# EAGLE design blimpy (EAGLE 9.5.0)
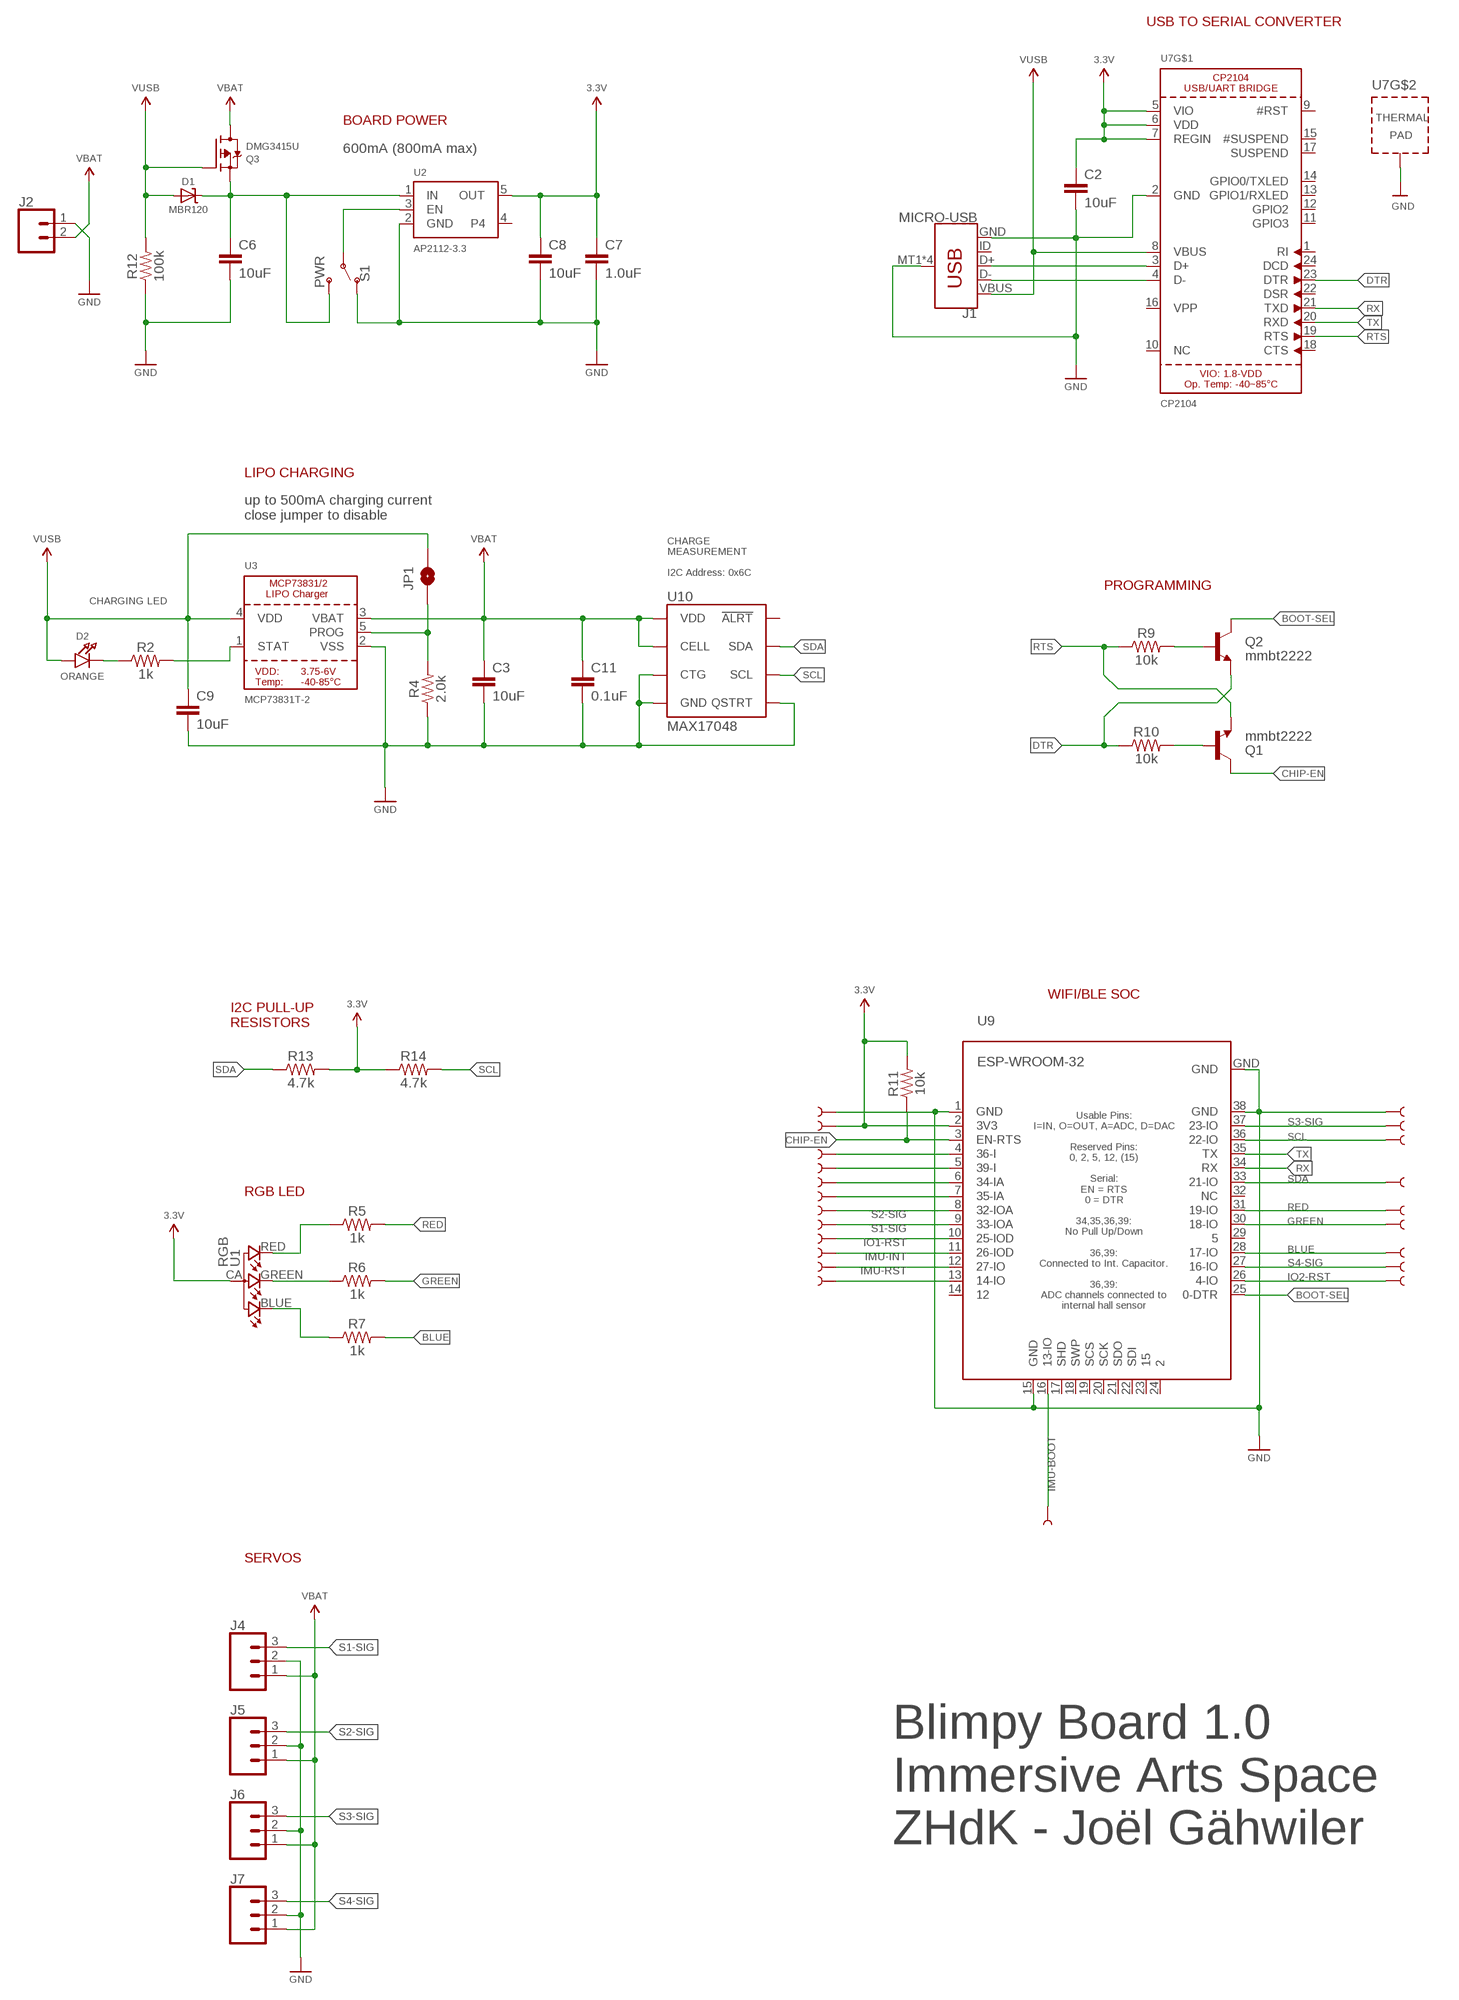
[diagram p0: schematic, sheet 1, part 1 of 2]
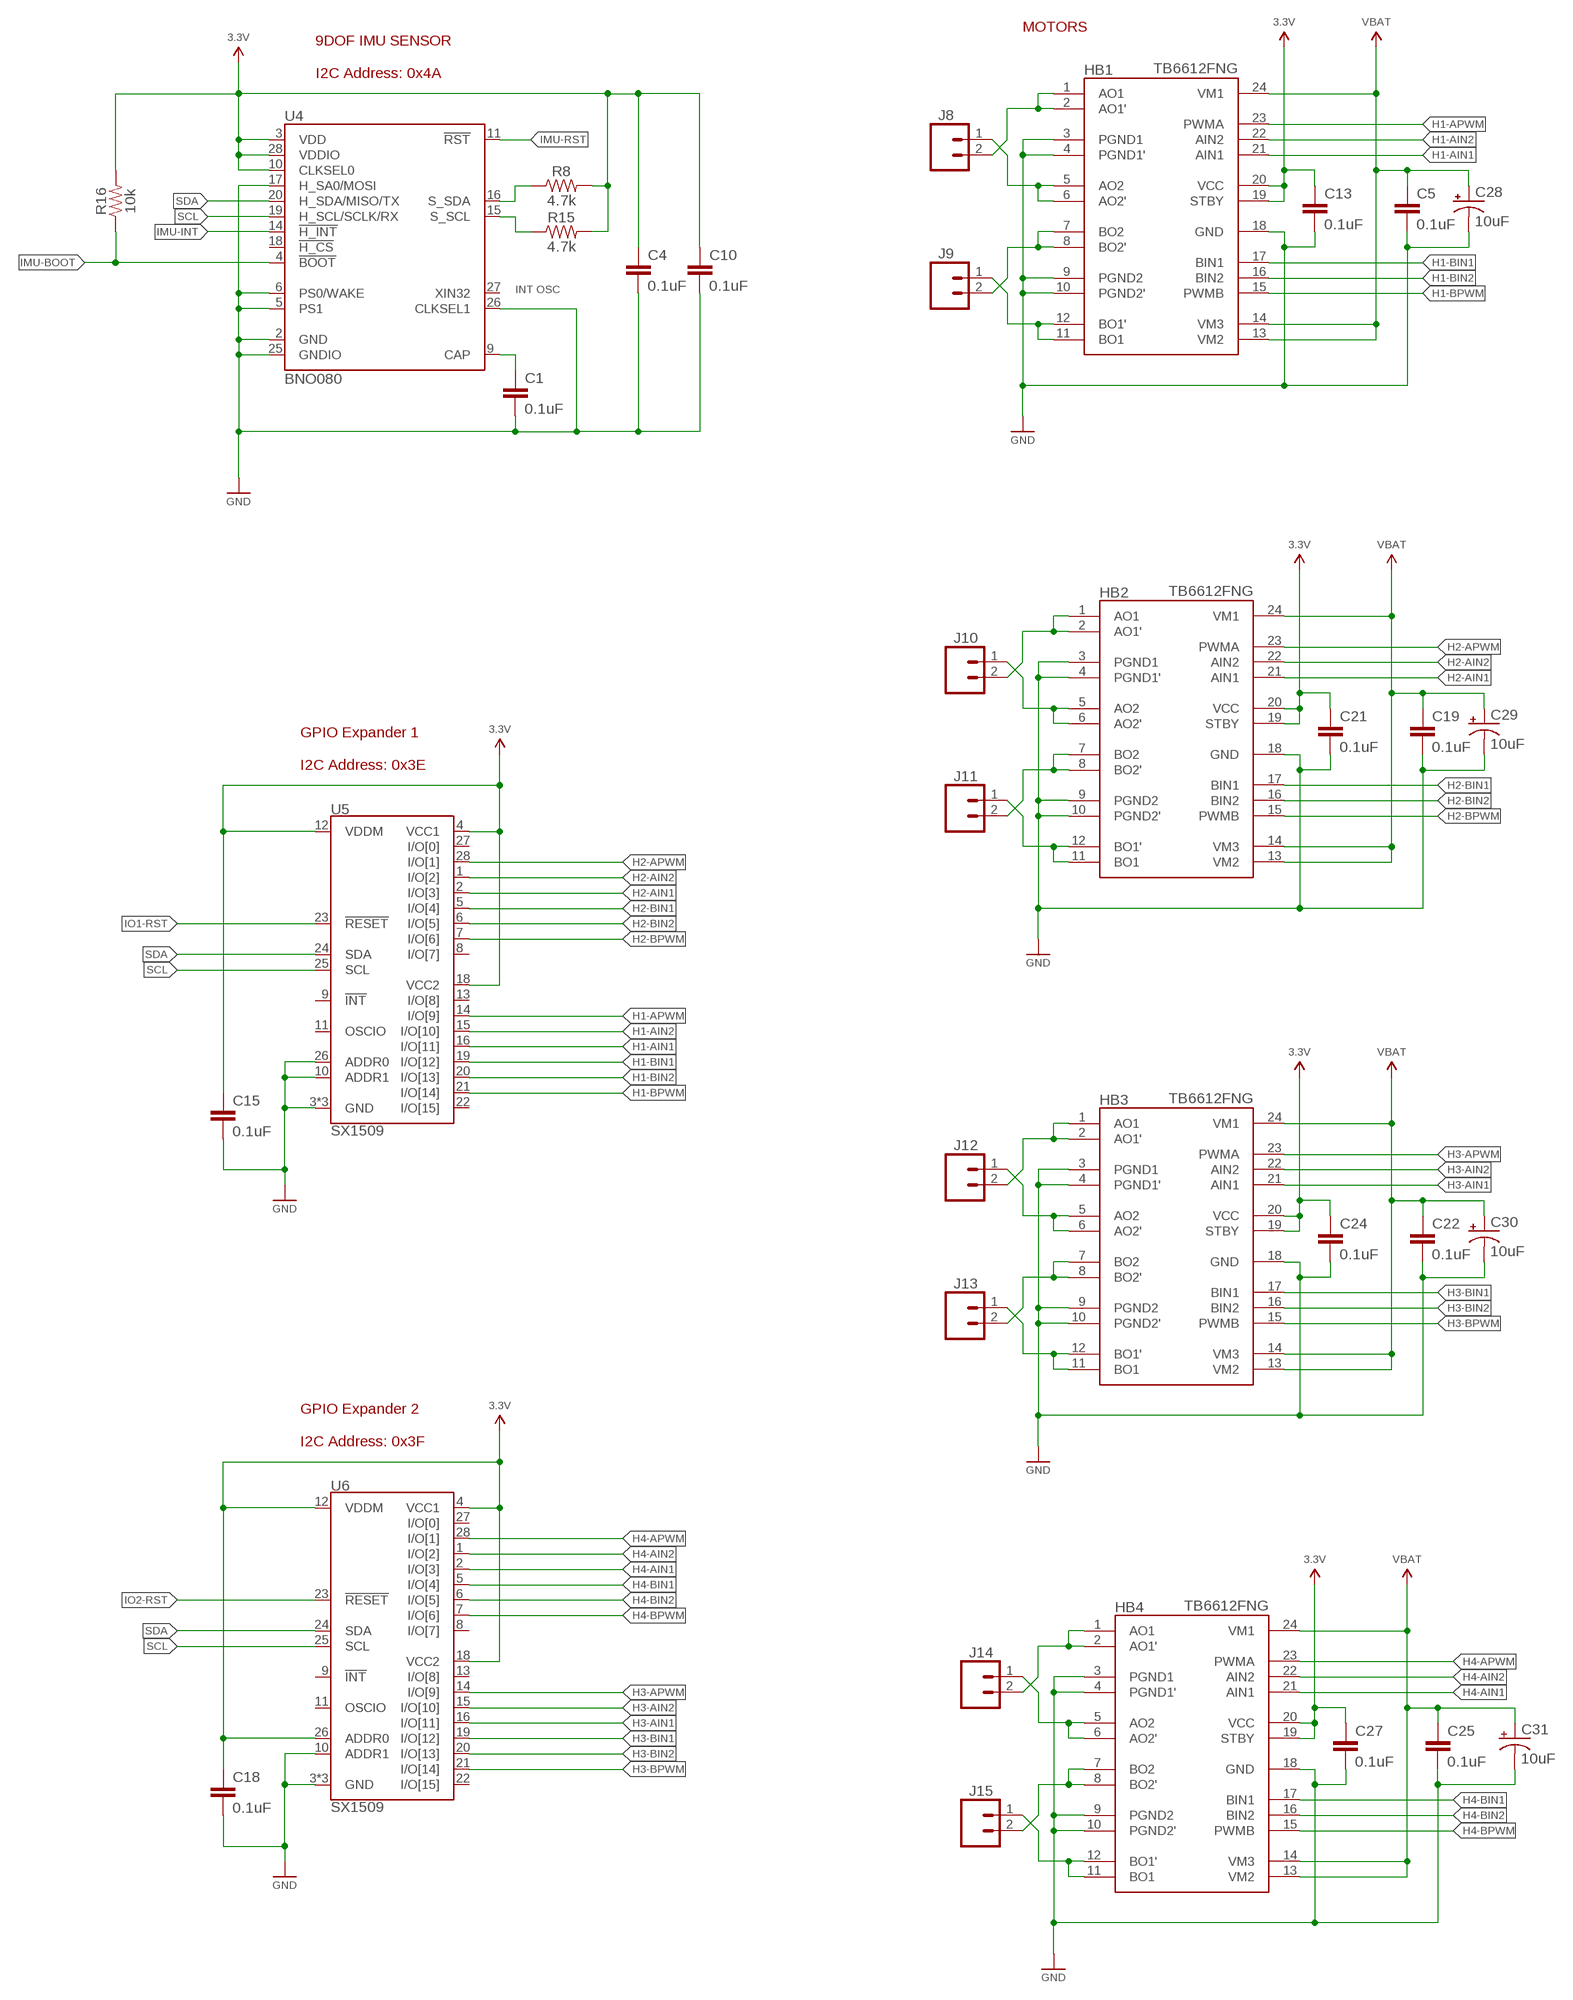
[diagram p1: schematic, sheet 1, part 2 of 2]

## Parts
C1  0.1uF  0.1UF-0603-25V-5%  [0603]
C2  10uF  10UF-0603-6.3V-20%  [0603]
C3  10uF  10UF-0603-6.3V-20%  [0603]
C4  0.1uF  0.1UF-0603-25V-5%  [0603]
C5  0.1uF  0.1UF-0603-25V-5%  [0603]
C6  10uF  10UF-0603-6.3V-20%  [0603]
C7  1.0uF  1.0UF-0603-16V-10%  [0603]
C8  10uF  10UF-0603-6.3V-20%  [0603]
C9  10uF  10UF-0603-6.3V-20%  [0603]
C10  0.1uF  0.1UF-0603-25V-5%  [0603]
C11  0.1uF  0.1UF-0603-25V-5%  [0603]
C13  0.1uF  0.1UF-0603-25V-5%  [0603]
C15  0.1uF  0.1UF-0603-25V-5%  [0603]
C18  0.1uF  0.1UF-0603-25V-5%  [0603]
C19  0.1uF  0.1UF-0603-25V-5%  [0603]
C21  0.1uF  0.1UF-0603-25V-5%  [0603]
C22  0.1uF  0.1UF-0603-25V-5%  [0603]
C24  0.1uF  0.1UF-0603-25V-5%  [0603]
C25  0.1uF  0.1UF-0603-25V-5%  [0603]
C27  0.1uF  0.1UF-0603-25V-5%  [0603]
C28  10uF  10UF-POLAR-EIA3216-16V-10%(TANT)  [EIA3216]
C29  10uF  10UF-POLAR-EIA3216-16V-10%(TANT)  [EIA3216]
C30  10uF  10UF-POLAR-EIA3216-16V-10%(TANT)  [EIA3216]
C31  10uF  10UF-POLAR-EIA3216-16V-10%(TANT)  [EIA3216]
D1  MBR120  DIODE-SCHOTTKYSOD-123  [SOD-123]
D2  ORANGE  LED0805_NOOUTLINE  [CHIPLED_0805_NOOUTLINE]
HB1  TB6612FNG  [SSOP24]
HB2  TB6612FNG  [SSOP24]
HB3  TB6612FNG  [SSOP24]
HB4  TB6612FNG  [SSOP24]
J1  MICRO-USB  USB_MICRO-B_SMT  [USB-MICROB]
J2  CONN_02-JST-2MM-SMT  [JST-2-SMD]
J4  3-PIN SMD  CONN_03JST-SMD  [JST-3-SMD]
J5  3-PIN SMD  CONN_03JST-SMD  [JST-3-SMD]
J6  3-PIN SMD  CONN_03JST-SMD  [JST-3-SMD]
J7  3-PIN SMD  CONN_03JST-SMD  [JST-3-SMD]
J8  CONN_02-JST-2MM-SMT  [JST-2-SMD]
J9  CONN_02-JST-2MM-SMT  [JST-2-SMD]
J10  CONN_02-JST-2MM-SMT  [JST-2-SMD]
J11  CONN_02-JST-2MM-SMT  [JST-2-SMD]
J12  CONN_02-JST-2MM-SMT  [JST-2-SMD]
J13  CONN_02-JST-2MM-SMT  [JST-2-SMD]
J14  CONN_02-JST-2MM-SMT  [JST-2-SMD]
J15  CONN_02-JST-2MM-SMT  [JST-2-SMD]
JP1  JUMPER-SMT_2_NO_SILK  [SMT-JUMPER_2_NO_SILK]
Q1  mmbt2222  TRANSISTOR_NPNSOT23-3  [SOT23-3]
Q2  mmbt2222  TRANSISTOR_NPNSOT23-3  [SOT23-3]
Q3  DMG3415U  MOSFET-P  [SOT23-R]
R2  1k  1KOHM-0603-1/10W-1%  [0603]
R4  2.0k  2.0KOHM-0603-1/10W-5%  [0603]
R5  1k  1KOHM-0603-1/10W-1%  [0603]
R6  1k  1KOHM-0603-1/10W-1%  [0603]
R7  1k  1KOHM-0603-1/10W-1%  [0603]
R8  4.7k  4.7KOHM-0603-1/10W-1%  [0603]
R9  10k  10KOHM-0603-1/10W-1%  [0603]
R10  10k  10KOHM-0603-1/10W-1%  [0603]
R11  10k  10KOHM-0603-1/10W-1%  [0603]
R12  100k  100KOHM-0603-1/10W-1%  [0603]
R13  4.7k  4.7KOHM-0603-1/10W-1%  [0603]
R14  4.7k  4.7KOHM-0603-1/10W-1%  [0603]
R15  4.7k  4.7KOHM-0603-1/10W-1%  [0603]
R16  10k  10KOHM-0603-1/10W-1%  [0603]
S1  PWR  SWITCH-SPDT-SMD-RIGHT-ANGLE  [SWITCH_SPST_SMD_A]
TP1  TEST-POINT3  [PAD.03X.03]
TP2  TEST-POINT3  [PAD.03X.03]
TP3  TEST-POINT3  [PAD.03X.03]
TP4  TEST-POINT3  [PAD.03X.03]
TP5  TEST-POINT3  [PAD.03X.03]
TP6  TEST-POINT3  [PAD.03X.03]
TP7  TEST-POINT3  [PAD.03X.03]
TP8  TEST-POINT3  [PAD.03X.03]
TP9  TEST-POINT3  [PAD.03X.03]
TP10  TEST-POINT3  [PAD.03X.03]
TP11  TEST-POINT3  [PAD.03X.03]
TP12  TEST-POINT3  [PAD.03X.03]
TP13  TEST-POINT3  [PAD.03X.03]
TP14  TEST-POINT3  [PAD.03X.03]
TP15  TEST-POINT3  [PAD.03X.03]
TP16  TEST-POINT3  [PAD.03X.03]
TP17  TEST-POINT3  [PAD.03X.03]
TP18  TEST-POINT3  [PAD.03X.03]
TP19  TEST-POINT3  [PAD.03X.03]
TP20  TEST-POINT3  [PAD.03X.03]
TP21  TEST-POINT3  [PAD.03X.03]
TP22  TEST-POINT3  [PAD.03X.03]
U1  RGB  RGB-LED-CLMVB-FKARGB  [PLCC4-2MM-RGB]
U2  AP2112-3.3  VREG_SOT23-5  [SOT23-5]
U3  MCP73831T-2  MCP73831/2  [SOT23-5]
U4  BNO080  [LGA-28]
U5  SX1509  [QFN-28]
U6  SX1509  [QFN-28]
U7  CP2104  [QFN24_4MM_SMSC]
U9  ESP-WROOM-32  [ESP-WROOM-32]
U10  MAX17048  MAX17048DFN8  [DFN-8]

## Nets
3.3V: C2.1 C4.1 C7.1 C8.1 C10.1 C13.1 C15.1 C18.1 C21.1 C24.1 C27.1 HB1.19(STBY) HB1.20(VCC) HB2.19(STBY) HB2.20(VCC) HB3.19(STBY) HB3.20(VCC) HB4.19(STBY) HB4.20(VCC) R8.2 R11.2 R13.2 R14.1 R15.2 R16.2 TP11.P$1 U1.CA U2.5(OUT) U4.3(VDD) U4.10(CLKSEL0) U4.28(VDDIO) U5.4(VCC1) U5.12(VDDM) U5.18(VCC2) U6.4(VCC1) U6.12(VDDM) U6.18(VCC2) U6.26(ADDR0) U7.5(VIO) U7.6(VDD) U7.7(REGIN) U9.2(3V3)
BLUE: R7.2 TP22.P$1 U9.28(17-IO)
BOOT-SEL: Q2.3(C) U9.25(0-DTR)
CHIP-EN: Q1.3(C) R11.1 U9.3(EN-RTS)
DTR: Q2.2(E) R10.1 U7.23(DTR)
GND: C1.2 C2.2 C3.2 C4.2 C5.2 C6.2 C7.2 C8.2 C9.2 C10.2 C11.2 C13.2 C15.2 C18.2 C19.2 C21.2 C22.2 C24.2 C25.2 C27.2 C28.- C29.- C30.- C31.- HB1.3(PGND1) HB1.4(PGND1') HB1.9(PGND2) HB1.10(PGND2') HB1.18(GND) HB2.3(PGND1) HB2.4(PGND1') HB2.9(PGND2) HB2.10(PGND2') HB2.18(GND) HB3.3(PGND1) HB3.4(PGND1') HB3.9(PGND2) HB3.10(PGND2') HB3.18(GND) HB4.3(PGND1) HB4.4(PGND1') HB4.9(PGND2) HB4.10(PGND2') HB4.18(GND) J1.GND J1.MT1(SHIELD) J1.MT2(SHIELD) J1.P$1(SHIELD) J1.P$2(SHIELD) J2.1 J4.2 J5.2 J6.2 J7.2 R4.1 R12.1 S1.1(O) TP12.P$1 TP13.P$1 U2.2(GND) U3.2(VSS) U4.2(GND) U4.5(PS1) U4.6(PS0/WAKE) U4.17(H_SA0/MOSI) U4.25(GNDIO) U4.26(CLKSEL1) U5.3(GND) U5.10(ADDR1) U5.17(GND) U5.26(ADDR0) U5.29(GND) U6.3(GND) U6.10(ADDR1) U6.17(GND) U6.29(GND) U7.2(GND) U7.THERM(TP) U9.1(GND) U9.15(GND) U9.38(GND) U9.GND U10.P$1(CTG) U10.P$4(GND) U10.P$6(QSTRT) U10.P$9(GND)
GREEN: R6.2 TP21.P$1 U9.30(18-IO)
H1-AIN1: HB1.21(AIN1) U5.16(I/O[11])
H1-AIN2: HB1.22(AIN2) U5.15(I/O[10])
H1-APWM: HB1.23(PWMA) U5.14(I/O[9])
H1-BIN1: HB1.17(BIN1) U5.19(I/O[12])
H1-BIN2: HB1.16(BIN2) U5.20(I/O[13])
H1-BPWM: HB1.15(PWMB) U5.21(I/O[14])
H2-AIN1: HB2.21(AIN1) U5.2(I/O[3])
H2-AIN2: HB2.22(AIN2) U5.1(I/O[2])
H2-APWM: HB2.23(PWMA) U5.28(I/O[1])
H2-BIN1: HB2.17(BIN1) U5.5(I/O[4])
H2-BIN2: HB2.16(BIN2) U5.6(I/O[5])
H2-BPWM: HB2.15(PWMB) U5.7(I/O[6])
H3-AIN1: HB3.21(AIN1) U6.16(I/O[11])
H3-AIN2: HB3.22(AIN2) U6.15(I/O[10])
H3-APWM: HB3.23(PWMA) U6.14(I/O[9])
H3-BIN1: HB3.17(BIN1) U6.19(I/O[12])
H3-BIN2: HB3.16(BIN2) U6.20(I/O[13])
H3-BPWM: HB3.15(PWMB) U6.21(I/O[14])
H4-AIN1: HB4.21(AIN1) U6.2(I/O[3])
H4-AIN2: HB4.22(AIN2) U6.1(I/O[2])
H4-APWM: HB4.23(PWMA) U6.28(I/O[1])
H4-BIN1: HB4.17(BIN1) U6.5(I/O[4])
H4-BIN2: HB4.16(BIN2) U6.6(I/O[5])
H4-BPWM: HB4.15(PWMB) U6.7(I/O[6])
HB1-A1: HB1.1(AO1) HB1.2(AO1') J8.2
HB1-A2: HB1.5(AO2) HB1.6(AO2') J8.1
HB1-B1: HB1.11(BO1) HB1.12(BO1') J9.1
HB1-B2: HB1.7(BO2) HB1.8(BO2') J9.2
HB2-A1: HB2.1(AO1) HB2.2(AO1') J10.2
HB2-A2: HB2.5(AO2) HB2.6(AO2') J10.1
HB2-B1: HB2.11(BO1) HB2.12(BO1') J11.1
HB2-B2: HB2.7(BO2) HB2.8(BO2') J11.2
HB3-A1: HB3.1(AO1) HB3.2(AO1') J12.2
HB3-A2: HB3.5(AO2) HB3.6(AO2') J12.1
HB3-B1: HB3.11(BO1) HB3.12(BO1') J13.1
HB3-B2: HB3.7(BO2) HB3.8(BO2') J13.2
HB4-A1: HB4.1(AO1) HB4.2(AO1') J14.2
HB4-A2: HB4.5(AO2) HB4.6(AO2') J14.1
HB4-B1: HB4.11(BO1) HB4.12(BO1') J15.1
HB4-B2: HB4.7(BO2) HB4.8(BO2') J15.2
IMU-BOOT: R16.1 TP17.P$1 U4.4(!BOOT) U9.16(13-IO)
IMU-INT: TP4.P$1 U4.14(!H_INT) U9.11(26-IOD)
IMU-RST: TP5.P$1 U4.11(!RST) U9.12(27-IO)
IO1-RST: TP3.P$1 U5.23(!RESET) U9.10(25-IOD)
IO2-RST: TP16.P$1 U6.23(!RESET) U9.26(4-IO)
N$1: D2.C R2.1
N$2: J1.D+ U7.3(D+)
N$3: R2.2 U3.1(STAT)
N$4: JP1.1 R4.2 U3.5(PROG)
N$6: J1.D- U7.4(D-)
N$7: C6.1 D1.C Q3.2(S) S1.3(S) U2.1(IN)
N$8: S1.2(P) U2.3(EN)
N$9: R5.1 U1.RED
N$10: R7.1 U1.BLUE
N$11: R6.1 U1.GREEN
N$12: Q1.1(B) R10.2
N$13: Q2.1(B) R9.2
N$14: R8.1 U4.16(S_SDA)
N$15: R15.1 U4.15(S_SCL)
N$16: C1.1 U4.9(CAP)
N$18: TP10.P$1 U9.4(36-I)
N$19: TP9.P$1 U9.5(39-I)
N$20: TP8.P$1 U9.6(34-IA)
N$21: TP7.P$1 U9.7(35-IA)
N$22: TP6.P$1 U9.13(14-IO)
RED: R5.2 TP20.P$1 U9.31(19-IO)
RTS: Q1.2(E) R9.1 U7.19(RTS)
RX: U7.21(TXD) U9.34(RX)
S1-SIG: J4.3 TP2.P$1 U9.9(33-IOA)
S2-SIG: J5.3 TP1.P$1 U9.8(32-IOA)
S3-SIG: J6.3 TP14.P$1 U9.37(23-IO)
S4-SIG: J7.3 TP15.P$1 U9.27(16-IO)
SCL: R14.2 TP18.P$1 U4.19(H_SCL/SCLK/RX) U5.25(SCL) U6.25(SCL) U9.36(22-IO) U10.P$7(SCL)
SDA: R13.1 TP19.P$1 U4.20(H_SDA/MISO/TX) U5.24(SDA) U6.24(SDA) U9.33(21-IO) U10.P$8(SDA)
TX: U7.20(RXD) U9.35(TX)
V_BATT: C3.1 C5.1 C11.1 C19.1 C22.1 C25.1 C28.+ C29.+ C30.+ C31.+ HB1.13(VM2) HB1.14(VM3) HB1.24(VM1) HB2.13(VM2) HB2.14(VM3) HB2.24(VM1) HB3.13(VM2) HB3.14(VM3) HB3.24(VM1) HB4.13(VM2) HB4.14(VM3) HB4.24(VM1) J2.2 J4.1 J5.1 J6.1 J7.1 Q3.3(D) U3.3(VBAT) U10.P$2(CELL) U10.P$3(VDD) ; supply symbol labelled VBAT
V_USB: C9.1 D1.A D2.A J1.VBUS JP1.2 Q3.1(G) R12.2 U3.4(VDD) U7.8(VBUS) ; supply symbol labelled VUSB
Unconnected: J1.ID U2.4 U4.18(!H_CS) U4.27(XIN32) U5.8(I/O[7]) U5.9(!INT) U5.11(OSCIO) U5.13(I/O[8]) U5.22(I/O[15]) U5.27(I/O[0]) U6.8(I/O[7]) U6.9(!INT) U6.11(OSCIO) U6.13(I/O[8]) U6.22(I/O[15]) U6.27(I/O[0]) U7.1(RI) U7.9(#RST) U7.10(NC) U7.11(GPIO3) U7.12(GPIO2) U7.13(GPIO1/RXLED) U7.14(GPIO0/TXLED) U7.15(#SUSPEND) U7.16(VPP) U7.17(SUSPEND) U7.18(CTS) U7.22(DSR) U7.24(DCD) U9.14 U9.17(SHD) U9.18(SWP) U9.19(SCS) U9.20(SCK) U9.21(SDO) U9.22(SDI) U9.23 U9.24 U9.29 U9.32(NC) U10.P$5(!ALRT)

## Notes on the sheet
- MOTORS
- USB TO SERIAL CONVERTER
- 9DOF IMU SENSOR
  
  I2C Address: 0x4A
- BOARD POWER
- 600mA (800mA max)
- INT OSC
- LIPO CHARGING
- up to 500mA charging current
  close jumper to disable
- CHARGE
  MEASUREMENT
  
  I2C Address: 0x6C
- PROGRAMMING
- CHARGING LED
- GPIO Expander 1
  
  I2C Address: 0x3E
- WIFI/BLE SOC
- I2C PULL-UP
  RESISTORS
- RGB LED
- GPIO Expander 2
  
  I2C Address: 0x3F
- SERVOS
- Blimpy Board 1.0
  Immersive Arts Space
  ZHdK - Joël Gähwiler

## Library data of the parts
C1 C4 C5 C10 C11 C13 C15 C18 C19 C21 C22 C24 C25 C27 = SparkFun-Capacitors:0.1UF: 0.1µF ceramic capacitors A capacitor is a passive two-terminal electrical component used to store electrical energy temporarily in an electric field.; PROD_ID: CAP-08604
C2 C3 C6 C8 C9 = SparkFun-Capacitors:10UF: 10.0µF ceramic capacitors A capacitor is a passive two-terminal electrical component used to store electrical energy temporarily in an electric field.; PROD_ID: CAP-11015
C7 = SparkFun-Capacitors:1.0UF: 1µF ceramic capacitors A capacitor is a passive two-terminal electrical component used to store electrical energy temporarily in an electric field.; PROD_ID: CAP-00868
C28-C31 = SparkFun-Capacitors:10UF-POLAR: 10.0µF polarized capacitors A capacitor is a passive two-terminal electrical component used to store electrical energy temporarily in an electric field.; PROD_ID: CAP-00811
D1 = microbuilder:DIODE-SCHOTTKY
D2 = microbuilder:LED: LED 0603 - 0603 Surface Mount Package 2mA: Green LED - Low Power (3.9mcd, 2ma, 1.7Vf) - Digikey: 475-2709-2-ND Orange LED - Low Power (9.8mcd, 2ma, 1.8Vf) - Digikey: 475-1194-2-ND Red LED - Low Power (5mcd, 2ma, 1.8Vf) - Digikey: 475-1195-2-ND Yellow LED - Low Power (7mcd, 2ma, 1.8Vf) - Digikey: 475-1196-2-ND 5mA: Blue LED - Low Power (17mcd, 5ma, 2.9Vf) - Digikey: LNJ937W8CRACT-ND 0805 - 0805 Surface Mount Package 2mA: Red LED (8.8mcd, 2mA, 1.8Vf, Clear) - Low Power [Digikey: 475-2510-1-ND] Green LED (5mcd, 2mA, 1.8Vf, Clear) - Low Power [Digikey: 475-2730-1-ND] Yellow LED (11.3mcd, 2mA, 1.8Vf, Clear) - Low Power [Digikey: 475-2555-1-ND] 20mA: Red LED (104mcd, 20mA, Diffused) - LS R976 [Digikey: 475-1278-6-ND] Red LED (12mcd, 20mA, 2.0Vf, Clear) - APT2012EC [Digikey: 754-1128-1-ND] Green LED (15mcd, 20mA, 2.2Vf, Clear) - APT2012GC [Digikey: 754-1131-1-ND] Orange LED (160mcd, 20mA, 2.1Vf, Clear) - APT2012SECK [Digikey: 754-1130-1-ND] 1206 - 1206 Surface Mount Package Green LED (26mcd, 20mA, Diffused) - LG N971 [Digikey: 475-1407-6-ND] Red LED (15mcd, 20mA, Diffused) - LH N974 [Digikey: 475-1416-6-ND] Cree - Cree High-Power Surface Mount LEDs XPEBWT-L1-0000-00D50 - White 111lm 350mA 2.9Vf 6200K 110° XTEAWT-00-0000-00000LEE3 - White 114lm 350mA 2.85Vf 5000K 115° Everlight - Everlight 45-21 Series Surface Mount LEDs 45-21/QK2C-B2832AC2CB2/2T - Warm White 2000mcd 20mA 3.25Vf 3050K 120° 45-21/LK2C-B38452C4CB2/2T - Nuetral White 2000mcd 20mA 3.25Vf 4150K 120° 45-21/LK2C-B50634C6CB2/2T - Cold White 2200mcd 20mA 3.25Vf 5650K 120° PLCC2 Reverse Mount LS T77K-J1L2-1-0-2-R18-Z - Red 11.25mcd 2mA 1.8Vf 630nm 120° LO T77K-L1M2-24-Z - Orange 19.6mcd 2mA 1.8Vf 606nm 120° LY T77K-K2M1-26-Z - Yellow 15.7mcd 2mA 1.8Vf 587nm 120°
HB1-HB4 = adafruit:TB6612FNG: TB6612FNG MOS dual H-bridge motor driver, 1.2A current 3.2A peak 3 or 5v logic and 3-15v motor
J1 = SparkFun-Connectors:USB_MICRO-B: USB Type Micro-B Connector Male/female and PTH/SMT variants SparkFun Products: SparkFun microB USB Breakout <https://www.sparkfun.com/products/12035> SparkFun USB microB Plug Breakout <https://www.sparkfun.com/products/10031> SparkFun ESP8266 Thing <https://www.sparkfun.com/products/13231>; PROD_ID: CONN-09505; SF_ID: PRT-08533
J2 J8-J15 = SparkFun-Connectors:CONN_02: Multi connection point. Often used as Generic Header-pin footprint for 0.1 inch spaced/style header connections On any of the 0.1 inch spaced packages, you can populate with these: Break Away Headers - Straight <https://www.sparkfun.com/products/116> (PRT-00116) Break Away Male Headers - Right Angle <https://www.sparkfun.com/products/553> (PRT-00553) Female Headers <https://www.sparkfun.com/products/115> (PRT-00115) Break Away Headers - Machine Pin <https://www.sparkfun.com/products/117> (PRT-00117) Break Away Female Headers - Swiss Machine Pin <https://www.sparkfun.com/products/743> (PRT-00743) For SCREWTERMINALS and SPRING TERMINALS visit here: Screw Terimnals on SparkFun.com <https://www.sparkfun.com/search/results?term=Screw+Terminals> (5mm/3.5mm/2.54mm spacing) This device is also useful as a general connection point to wire up your design to another part of your project. Our various solder wires solder well into these plated through hole pads. Hook-Up Wire - Assortment (Stranded, 22 AWG) <https://www.sparkfun.com/products/11375> (PRT-11375) Hook-Up Wire - Assortment (Solid Core, 22 AWG) <https://www.sparkfun.com/products/11367> (PRT-11367) View the entire wire category on our website here <https://www.sparkfun.com/categories/141> Special notes: Molex polarized connector foot print use with: PRT-08233 with associated crimp pins and housings. 2.54_SCREWTERM for use with PRT-10571. 3.5mm Screw Terminal footprints for PRT-08084 5mm Screw Terminal footprints for use with PRT-08432; PROD_ID: CONN-11443
J4-J7 = SparkFun-Connectors:CONN_03: Multi connection point. Often used as Generic Header-pin footprint for 0.1 inch spaced/style header connections On any of the 0.1 inch spaced packages, you can populate with these: Break Away Headers - Straight <https://www.sparkfun.com/products/116> (PRT-00116) Break Away Male Headers - Right Angle <https://www.sparkfun.com/products/553> (PRT-00553) Female Headers <https://www.sparkfun.com/products/115> (PRT-00115) Break Away Headers - Machine Pin <https://www.sparkfun.com/products/117> (PRT-00117) Break Away Female Headers - Swiss Machine Pin <https://www.sparkfun.com/products/743> (PRT-00743) Stackable Header - 3 Pin (Female, 0.1") <https://www.sparkfun.com/products/13875> (PRT-13875) For SCREWTERMINALS and SPRING TERMINALS visit here: Screw Terimnals on SparkFun.com <https://www.sparkfun.com/search/results?term=Screw+Terminals> (5mm/3.5mm/2.54mm spacing) This device is also useful as a general connection point to wire up your design to another part of your project. Our various solder wires solder well into these plated through hole pads. Hook-Up Wire - Assortment (Stranded, 22 AWG) <https://www.sparkfun.com/products/11375> (PRT-11375) Hook-Up Wire - Assortment (Solid Core, 22 AWG) <https://www.sparkfun.com/products/11367> (PRT-11367) View the entire wire category on our website here <https://www.sparkfun.com/categories/141> Special notes: Molex polarized connector foot print use with SKU : PRT-08232 with associated crimp pins and housings.; PROD_ID: CONN-12591
JP1 = SparkFun-Jumpers:JUMPER-SMT_2_NO: Normally open jumper This jumper has two pads in close proximity to each other. Apply solder to close the connection. Round pads are easier to solder for beginners, but are a lot larger. SparkFun Product that uses the round pads: SparkFun EL Sequencer <https://www.sparkfun.com/products/12781>
Q1 Q2 = SparkFun:TRANSISTOR_NPN: Transistor NPN BJT configuration in SOT23 package. MMBT2222 is the common NPN we use. Double check BCE configuration again layout.
Q3 = microbuilder:MOSFET-P: P-Channel Mosfet LEGEND VDS: Voltage Drain-Source ID: Drain Current RDS(ON): Drain-Source On-State Resistance VGS(TH): Gate-Source Threshold Voltage CISS: Drain-Source Input Capacitance SOT-23 Name VDS ID RDS(ON) VGS(TH) CISS Order Number IRLML5103 30V 760mA 600 mOhm -- 75pF @ 25V Digikey: IRLML5103PBFCT-ND IRLML6401 12V 4.3A 50 mOhm 950mV @ 250µA 830pF @ 10V Digikey: IRLML6401PBFTR-ND NTR0202PL 20V 400mA 800 mOhm 2.3V @ 250uA 70pF @ 5V Digikey: NTR0202PLT1GOSTR-ND NTR4101PT1G 20V 1.8A 85 mOhm 1.2V @ 250uA 675pF @ 10V Digikey: NTR4101PT1GOSCT-ND DMP2004K 20V 600mA 900 mOhm 1V @ 250uA 175pF @ 16V Digikey: DMP2004KDICT-ND PMV65XP 20V 3.9A 76 mOhm 950mV @ 1mA 725pF @ 20V Digikey: 568-2358-2-ND TO-252 Name VDS ID RDS(ON) VGS(TH) CISS Order Number AOD417 30V 25A 34 mOhm 3V @ 250µA 920pF @ 15V Digikey: 785-1106-2-ND PowerPak Name VDS ID RDS(ON) VGS(TH) CISS Order Number AON7401 30V 12A 14 mOhm 3V @ 250µA 2600pF @ 15V Digikey: 785-1302-1-ND
R2 R5-R7 = SparkFun-Resistors:1KOHM: 1kΩ resistor A resistor is a passive two-terminal electrical component that implements electrical resistance as a circuit element. Resistors act to reduce current flow, and, at the same time, act to lower voltage levels within circuits. - Wikipedia; PROD_ID: RES-07856
R4 = SparkFun-Resistors:2.0KOHM: 2kΩ resistor A resistor is a passive two-terminal electrical component that implements electrical resistance as a circuit element. Resistors act to reduce current flow, and, at the same time, act to lower voltage levels within circuits. - Wikipedia; PROD_ID: RES-08296
R8 R13-R15 = SparkFun-Resistors:4.7KOHM: 4.7kΩ resistor A resistor is a passive two-terminal electrical component that implements electrical resistance as a circuit element. Resistors act to reduce current flow, and, at the same time, act to lower voltage levels within circuits. - Wikipedia; PROD_ID: RES-07857
R9-R11 R16 = SparkFun-Resistors:10KOHM: 10kΩ resistor A resistor is a passive two-terminal electrical component that implements electrical resistance as a circuit element. Resistors act to reduce current flow, and, at the same time, act to lower voltage levels within circuits. - Wikipedia; PROD_ID: RES-00824
R12 = SparkFun-Resistors:100KOHM: 100kΩ resistor A resistor is a passive two-terminal electrical component that implements electrical resistance as a circuit element. Resistors act to reduce current flow, and, at the same time, act to lower voltage levels within circuits. - Wikipedia; PROD_ID: RES-07828
S1 = SparkFun-Switches:SWITCH-SPDT: Single Pole, Double Throw (SPDT) Switch Single-pole, double-throw (SPDT) switch. Variant Overview SMD-AYZ0202 Surface Mount DPDT Switch <https://www.sparkfun.com/products/597> (COM-00597) Used on e.g. LilyPad Arduino USB - ATmega32U4 Board <https://www.sparkfun.com/products/12049> PTH-11.6X4.0MM SPDT Mini Power Switch <https://www.sparkfun.com/products/102> (COM-00102) Used on e.g. SparkFun Simon Says - Through-Hole Soldering Kit <https://www.sparkfun.com/products/10547> (KIT-10547) PTH-11.6X4.0MM-KIT KIT version of SPDT Mini Power Switch - Simplifies soldering by removing tStop of switch pins - only one side can be soldered. PTH-11.6X4.0MM-LOCK LOCK version of SPDT Mini Power Switch - Offset pins hold switch in place for easier soldering. SMD-RIGHT-ANGLE Surface Mount Right Angle Switch <https://www.sparkfun.com/products/10860> (COM-10860) Used on e.g. SparkFun ESP8266 Thing <https://www.sparkfun.com/products/13231>; PROD_ID: SWCH-10651; SF_SKU: COM-10860
TP1-TP22 = SparkFun-Connectors:TEST-POINT: SparkFun Test Points Bare copper test points for troubleshooting or In-Circuit-Testing. These are used by our Production team for verifying production board runs using pogo-pins on test beds. SparkFun Products: SparkFun LSM9DS1 Breakout <https://www.sparkfun.com/products/13284> SparkFun PSOC <https://www.sparkfun.com/products/13714> SparkFun Load Cell Amplifier <https://www.sparkfun.com/products/13879>
U1 = Particle:RGB-LED-CLMVB-FKA: CREE CLMVB-FKA RGB LED 2mm x 2mm
U2 = microbuilder:VREG_SOT23-5: SOT23-5 Fixed Voltage Regulators Part Current Out V Out V In V Dropout θJA (°C/W) TJ (°C) Digikey Part No. ADP121 150mA 3.3V 3.4-5.5V 0.09V @ 150mA -- -- ADP121-AUJZ33R7CT-ND ADP121 150mA 3.0V 3.1-5.5V 0.09V @ 150mA -- -- ADP121-AUJZ30R7CT-ND ADP122 300mA 3.3V 3.4-5.5V 0.085V @ 300mA -- -- ADP122AUJZ-3.3-R7CT-ND ADP1712 300mA 3.3V 3.5-5.5V 0.17V @ 300mA -- -- ADP1712AUJZ-3.3-R7TR-ND AP7311 (Low Cost) 150mA 3.3V 3.5-6V 0.15V @ 150mA -- -- AP7311-33WG-7DICT-ND LD39015M18R 150mA 1.8V 1.9V-5.5V 0.08V @ 100mA -- -- 497-6977-1-ND LP2985A-33DBVR 150mA 3.3V 3.3-16V 0.28V @ 150mA 206 150 296-18479-1-ND MCP1824T-3302E/OT 300mA 3.3V 3.5V-6V 0.2V @ 300mA -- -- MCP1824T-3302E/OTCT-ND MIC5205-2.5YM5 TR 150mA 2.5V 2.7-16V 0.165V @ 150mA -- -- 576-1257-2-ND MIC5205-3.0YM5 TR 150mA 3.0V 3.2V-16V 0.165V @ 150mA -- -- 576-1258-2-ND MIC5205-3.3YM5 TR 150mA 3.3V 3.5V-16V 0.165V @ 150mA -- -- 576-1259-2-ND TPS780330220 150mA 3.3V+2.2V 3.6-5.5V 250mV Max -- -- 296-23332-1-ND TDA3663/N1,135 100mA 3.3V 3.5-45V 0.18V @ 50mA -- -- 568-5343-1-ND Max operating temp can be calculated using θJA, TJ (max junction temperature), and power in watts. Set the "Maximum Ambient Temperature" until it reaches TJ ("Max Junction Temperature"), which is the absolute limit for safe use of the regulator: Heat Sink Temperature Calculator <http://www.daycounter.com/Calculators/Heat-Sink-Temperature-Calculator.phtml> For example, With 12V source into a 3.3V LP2985 and a 30mA load, we are dissipating (12V-3.3V) * 0.03A = 0.261W. With a θJA of 206 °C/W, a TJ of 150°C, and 261mW we can safely use the chip without a heat sink up to 75°C (=147.1°C Junction Temperature).
U3 = microbuilder:MCP73831/2: MCP73831/2 LIPO Charger VDD: 3.75 - 6V Temp -40 - 85°C Programmable Charge Rate: 15-500mA NOTE: STAT is a tri-state logic output on the MCP73831 and an open-drain output on the MCP73832. SOT23-5 with 4.2V output and tri-state logic on STAT = MCP73831T-2ACI/OT
U4 = BNO080:BNO080
U5 U6 = SparkFun-IC-Special-Function:SX1509: Semtech SX1509 The SX1509 is a complete ultra low voltage 1.2V to 3.6V General Purpose parallel Input/Output (GPIO) expanders ideal for low power handheld battery powered equipment. This version comes in a 16-channel configuration and allows easy serial expansion of I/O through a standard 400kHz I2C interface. GPIO devices can provide additional control and monitoring when the microcontroller or chipset has insufficient I/O ports, or in systems where serial communication and control from a remote location is advantageous. Datasheet <http://cdn.sparkfun.com/datasheets/BreakoutBoards/sx1509.pdf> SparkFun Products SparkFun 16 Output I/O Expander Breakout - SX1509 <https://www.sparkfun.com/products/13601> (BOB-13601) SparkFun Line Follower Array <https://www.sparkfun.com/products/13582> (SEN-13582); PROD_ID: IC-11311
U7 = microbuilder:CP2104: CP2104 - USB to UART Bridge VDD Output: 3.45V
U9 = ESP32:ESP-WROOM-32
U10 = SparkFun-IC-Power:MAX17048: Micropower 1-Cell Li+ ModelGauge SparkFun Products Qduino Mini <https://www.sparkfun.com/products/13614> (DEV-13614); PROD_ID: IC-12551

## Board
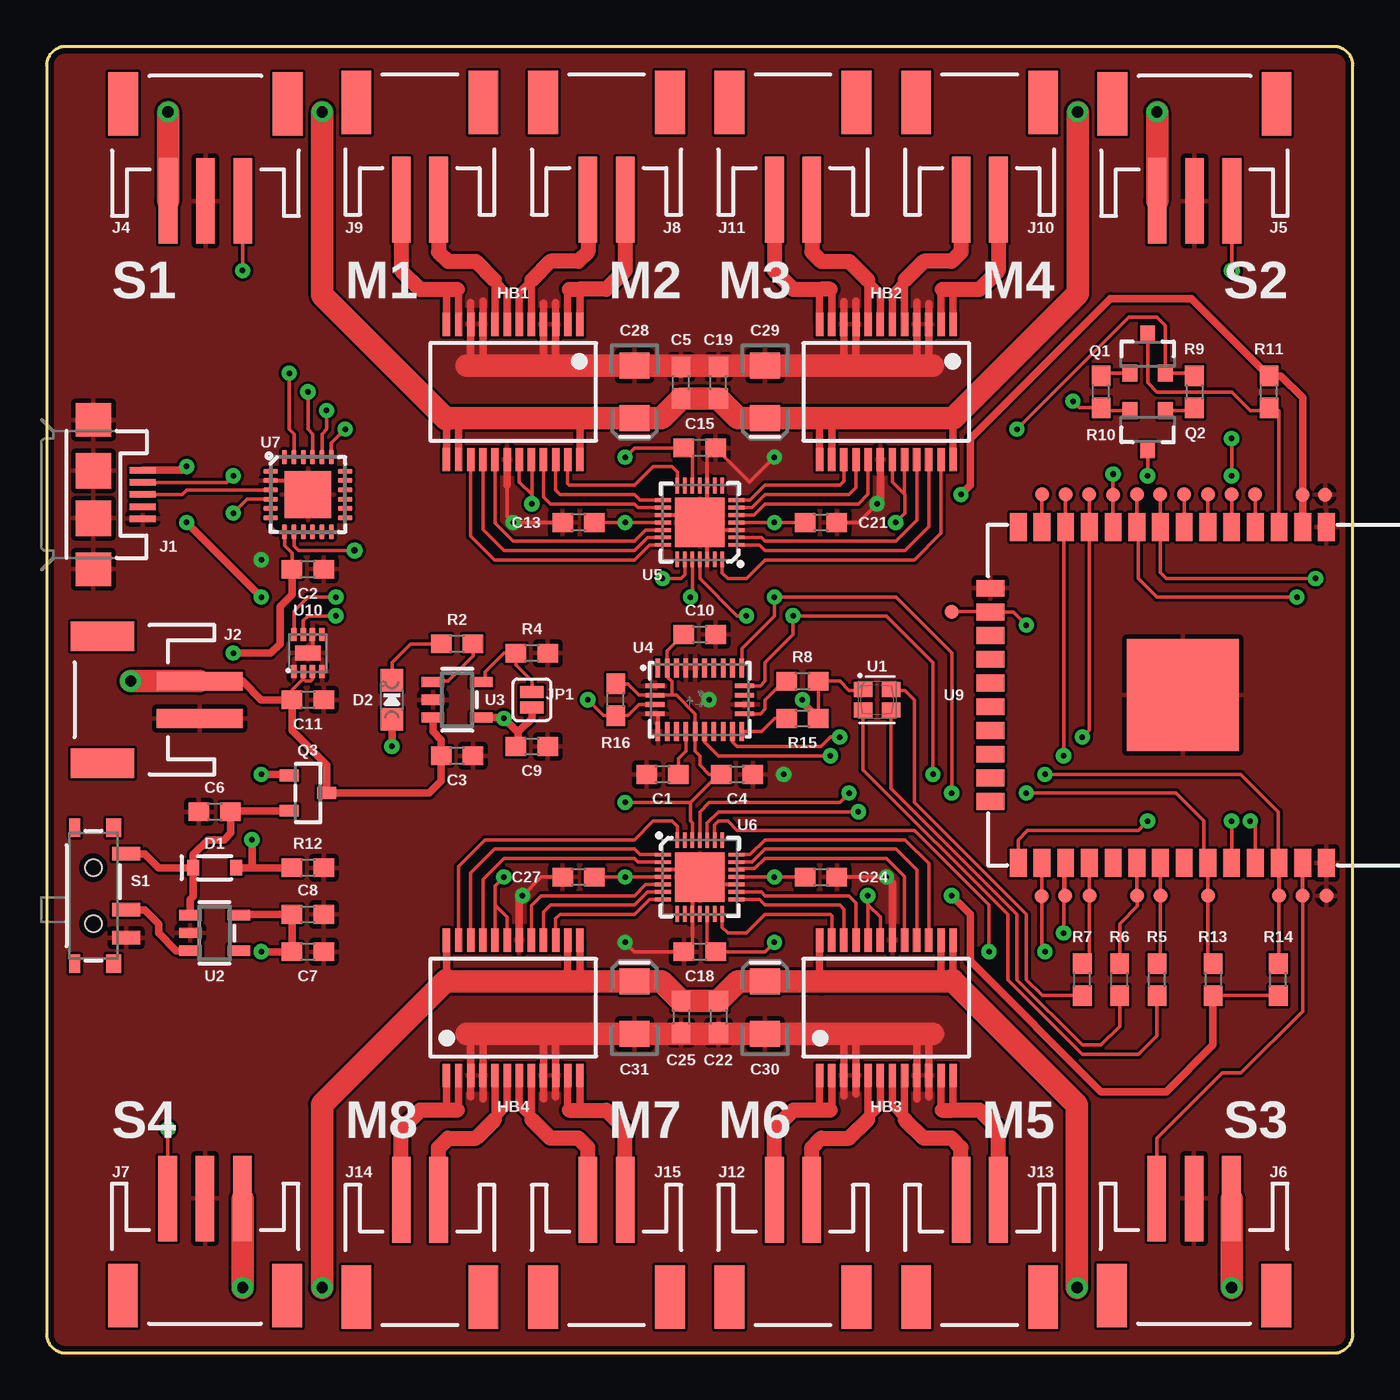
[diagram p2: board, top side]
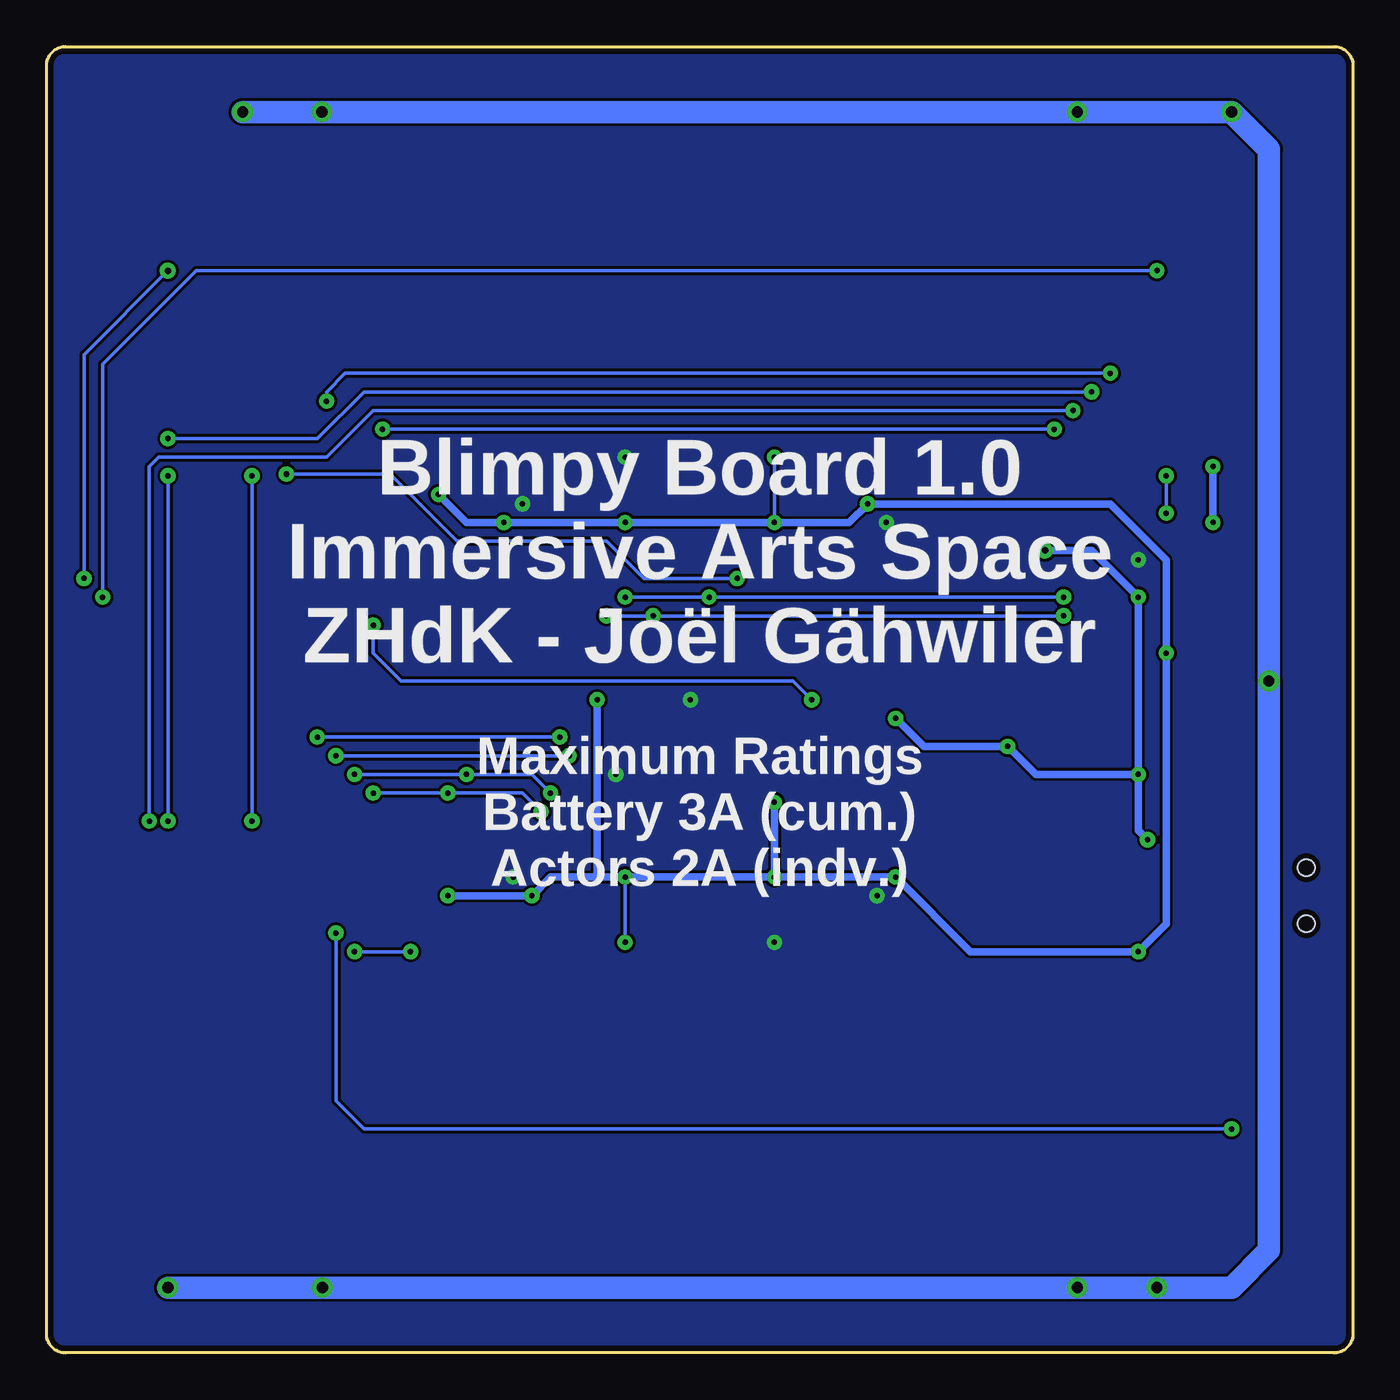
[diagram p3: board, bottom side, seen from below]

Size 70 x 70 mm. Coordinates in mm from the lower left corner, seen from the top.
Outline: 69,0 arc90 70,1 70,69 arc90 69,70 1,70 arc90 0,69 0,1 arc90 1,0 69,0
Copper layers (1*16): Top 0.035mm / dielectric 1mm / Bottom 0.035mm
Design rules "SparkFun-2-layer-STANDARD *": minimum track width 6mil, minimum drill 0.3mm, track to track 6mil, track to pad 6mil, pad to pad 6mil, via to via 6mil, smd to smd 6mil, copper to edge 12mil, drill to drill 12mil, minimum pad ring 10mil, minimum via ring 10mil, stop-mask expansion 4mil, vias tented up to drill 25mil, thermal gap 10mil

### Footprints (pad centres in the part's own frame; a part is rotated, then mirrored left to right if it is on the bottom)
0603 = smd 1.1 x 1: 1 -0.85,0; 2 0.85,0
EIA3216 = smd 1.4 x 1.6: + 1.4,0; - -1.4,0
SOD-323 = smd 0.63 x 0.83: A 1.15,0; C -1.15,0
CHIPLED_0805_NOOUTLINE = smd 1.2 x 1.2: A 0,-1.05; C 0,1.05
SSOP24 = smd 0.4 x 1.25: 1 -3.575,-3.625; 2 -2.925,-3.625; 3 -2.275,-3.625; 4 -1.625,-3.625; 5 -0.975,-3.625; 6 -0.325,-3.625; 7 0.325,-3.625; 8 0.975,-3.625; 9 1.625,-3.625; 10 2.275,-3.625; 11 2.925,-3.625; 12 3.575,-3.625; 13 3.575,3.625; 14 2.925,3.625; 15 2.275,3.625; 16 1.625,3.625; 17 0.975,3.625; 18 0.325,3.625; 19 -0.325,3.625; 20 -0.975,3.625; 21 -1.625,3.625; 22 -2.275,3.625; 23 -2.925,3.625; 24 -3.575,3.625
USB-MICROB = smd 1.4 x 0.35: D+ -2.65,0; D- -2.65,-0.65; GND -2.65,1.3; ID -2.65,0.65; VBUS -2.65,-1.3 | smd 1.9 x 1.8: MT1 0,-4; MT2 0,4 | smd 1.9 x 1.9: P$1 0,-1.27; P$2 0,1.27
JST-2-SMD = smd 1 x 4.6: 1 -1,-3.7; 2 1,-3.7 | smd 1.6 x 3.4: NC1 -3.4,1.5; NC2 3.4,1.5
JST-3-SMD = smd 1 x 4.6: 1 -1.99,-4.77; 2 0.01,-4.77; 3 2.01,-4.77 | smd 1.6 x 3.4: NC1 -4.39,0.43; NC2 4.41,0.43
SMT-JUMPER_2_NO_SILK = smd 0.635 x 1.27: 1 -0.406,0; 2 0.406,0
SOT23-3 = smd 0.8 x 0.9: 1 -0.95,-1; 2 0.95,-1; 3 0,1.1
SOT23-R = smd 0.635 x 1.016: 1 -0.95,-1; 2 0.95,-1; 3 0,1
SWITCH_SPST_SMD_A = smd 0.7 x 1.5: 1 -2.25,-1.75; 2 -0.75,-1.75; 3 2.25,-1.75 | smd 1 x 0.6: GND1 -3.65,1; GND3 3.65,1 | smd 1 x 0.8: GND2 -3.65,-1.1; GND4 3.65,-1.1 | hole 0.9: -1.5,0; 1.5,0
PAD.03X.03 = smd 0.762 x 0.762: P$1 0,0
PLCC4-2MM-RGB = smd 1 x 0.8: BLUE -0.75,-0.55; CA 0.75,-0.55; GREEN -0.75,0.55; RED 0.75,0.55
SOT23-5 = smd 0.55 x 1.2: 1 -0.95,-1.3; 2 0,-1.3; 3 0.95,-1.3; 4 0.95,1.3; 5 -0.95,1.3
LGA-28 = smd 1 x 0.25: 1 1.7,2.25; 6 -1.7,2.25; 7 -1.7,1.75; 8 -1.7,1.25; 9 -1.7,0.75; 10 -1.7,0.25; 11 -1.7,-0.25; 12 -1.7,-0.75; 13 -1.7,-1.25; 14 -1.7,-1.75; 15 -1.7,-2.25; 20 1.7,-2.25; 21 1.7,-1.75; 22 1.7,-1.25; 23 1.7,-0.75; 24 1.7,-0.25; 25 1.7,0.25; 26 1.7,0.75; 27 1.7,1.25; 28 1.7,1.75 | smd 0.25 x 1: 2 0.75,2.4; 3 0.25,2.4; 4 -0.25,2.4; 5 -0.75,2.4; 16 -0.75,-2.4; 17 -0.25,-2.4; 18 0.25,-2.4; 19 0.75,-2.4
QFN-28 = smd 0.85 x 0.2: 1 -1.975,1.2; 2 -1.975,0.8; 3 -1.975,0.4; 4 -1.975,0; 5 -1.975,-0.4; 6 -1.975,-0.8; 7 -1.975,-1.2; 15 1.975,-1.2; 16 1.975,-0.8; 17 1.975,-0.4; 18 1.975,0; 19 1.975,0.4; 20 1.975,0.8; 21 1.975,1.2 | smd 0.2 x 0.85: 8 -1.2,-1.975; 9 -0.8,-1.975; 10 -0.4,-1.975; 11 0,-1.975; 12 0.4,-1.975; 13 0.8,-1.975; 14 1.2,-1.975; 22 1.2,1.975; 23 0.8,1.975; 24 0.4,1.975; 25 0,1.975; 26 -0.4,1.975; 27 -0.8,1.975; 28 -1.2,1.975 | smd 2.65 x 2.65: 29 0,0
QFN24_4MM_SMSC = smd 0.8 x 0.28: 1 -2,1.25; 2 -2,0.75; 3 -2,0.25; 4 -2,-0.25; 5 -2,-0.75; 6 -2,-1.25; 13 2,-1.25; 14 2,-0.75; 15 2,-0.25; 16 2,0.25; 17 2,0.75; 18 2,1.25 | smd 0.28 x 0.8: 7 -1.25,-2; 8 -0.75,-2; 9 -0.25,-2; 10 0.25,-2; 11 0.75,-2; 12 1.25,-2; 19 1.25,2; 20 0.75,2; 21 0.25,2; 22 -0.25,2; 23 -0.75,2; 24 -1.25,2 | smd 2.5 x 2.5: THERM 0,0
ESP-WROOM-32 = smd 0.9 x 1.5: 1 7.7,9; 2 6.43,9; 3 5.16,9; 4 3.89,9; 5 2.62,9; 6 1.35,9; 7 0.08,9; 8 -1.19,9; 9 -2.46,9; 10 -3.73,9; 11 -5,9; 12 -6.27,9; 13 -7.54,9; 14 -8.81,9; 25 -8.81,-9; 26 -7.54,-9; 27 -6.27,-9; 28 -5,-9; 29 -3.73,-9; 30 -2.46,-9; 31 -1.19,-9; 32 0.08,-9; 33 1.35,-9; 34 2.62,-9; 35 3.89,-9; 36 5.16,-9; 37 6.43,-9; 38 7.7,-9 | smd 1.5 x 0.9: 15 -10.3,5.715; 16 -10.3,4.445; 17 -10.3,3.175; 18 -10.3,1.905; 19 -10.3,0.635; 20 -10.3,-0.635; 21 -10.3,-1.905; 22 -10.3,-3.175; 23 -10.3,-4.445; 24 -10.3,-5.715 | smd 6 x 6: GND 0,0
DFN-8 = smd 0.3 x 0.7: P$1 -0.75,-0.99; P$2 -0.25,-0.99; P$3 0.25,-0.99; P$4 0.75,-0.99; P$5 0.75,0.99; P$6 0.25,0.99; P$7 -0.25,0.99; P$8 -0.75,0.99 | smd 1.38 x 0.8: P$9 0,0

### Placement (x,y rotation side)
C1  33,31 180 top
C2  14,42 0 top
C3  22,32 0 top
C4  37,31 0 top
C5  34,52 90 top
C6  9,29 180 top
C7  14,21.5 0 top
C8  14,23.5 0 top
C9  26,32.5 0 top
C10  35,38.5 0 top
C11  14,35 0 top
C13  28.5,44.5 180 top
C15  35,48.5 0 top
C18  35,21.5 180 top
C19  36,52 90 top
C21  41.5,44.5 0 top
C22  36,18 270 top
C24  41.5,25.5 0 top
C25  34,18 270 top
C27  28.5,25.5 180 top
C28  31.5,51.5 270 top
C29  38.5,51.5 270 top
C30  38.5,18.5 90 top
C31  31.5,18.5 90 top
D1  1A/23V/620mV  [SOD-323]  9,26 0 top
D2  18.5,35 0 top
HB1  25,51.5 180 top
HB2  45,51.5 180 top
HB3  45,18.5 0 top
HB4  25,18.5 0 top
J1  2.5,46 180 top
J2  4.5,35 90 top
J4  8.5,66.5 0 top
J5  61.5,66.5 0 top
J6  61.5,3.5 180 top
J7  8.5,3.5 180 top
J8  30,65.5 0 top
J9  20,65.5 0 top
J10  50,65.5 0 top
J11  40,65.5 0 top
J12  40,4.5 180 top
J13  50,4.5 180 top
J14  20,4.5 180 top
J15  30,4.5 180 top
JP1  26,35 270 top
Q1  59,53.5 0 top
Q2  59,49.5 180 top
Q3  14,30 270 top
R2  22,38 0 top
R4  26,37.5 180 top
R5  59.5,20 90 top
R6  57.5,20 90 top
R7  55.5,20 90 top
R8  40.5,36 0 top
R9  61.5,51.5 270 top
R10  56.5,51.5 90 top
R11  65.5,51.5 90 top
R12  14,26 180 top
R13  62.5,20 270 top
R14  66,20 90 top
R15  40.5,34 0 top
R16  30.5,35 90 top
S1  2.5,24.5 90 top
TP1  59.68,46 0 top
TP2  58.44,46.01 0 top
TP3  57.15,45.99 0 top
TP4  55.88,46 0 top
TP5  54.6,46.01 0 top
TP6  53.35,46.01 0 top
TP7  60.96,46.01 0 top
TP8  62.24,46.01 0 top
TP9  63.5,46 0 top
TP10  64.77,46 0 top
TP11  67.3,45.99 0 top
TP12  68.52,45.99 0 top
TP13  68.58,24.49 0 top
TP14  67.3,24.51 0 top
TP15  54.58,24.51 0 top
TP16  53.33,24.48 0 top
TP17  48.49,39.72 0 top
TP18  66.06,24.5 0 top
TP19  62.23,24.5 0 top
TP20  59.69,24.5 0 top
TP21  58.43,24.5 0 top
TP22  55.88,24.51 0 top
U1  44.5,35 180 top
U2  9,22.5 270 top
U3  22,35 270 top
U4  35,35 90 top
U5  35,44.5 180 top
U6  35,25.5 0 top
U7  14,46 0 top
U9  60.88,35.26 0 top
U10  14,37.5 0 top

### Tracks (layer width: path | path; a pad name or v marks a point on that pad's centre or on a via)
3.3V  (via drill 0.3)
  Top 0.2: U6.26 34.6,28.4 34.5,28.5 34.5,29.5 | HB1.20 26,47.85 26,46 | HB1.19 25.32,46.67 26,46 | HB2.20 45.98,46.02 | HB2.19 45.33,46.67 45.98,46.02 | 45.98,46.02 46,46 46,45 v45.5,44.5 | C13.1 v31,44.5 U5.18 | U5.4 v39,44.5 C21.1 | 26,46 v26,45.5 | v31,48 31.5,48.5 C15.1 34.6,48.05 U5.12 | U6.12 35.4,21.95 C18.1 38.5,21.5 v39,22 | C24.1 v39,25.5 U6.18 | U6.4 v31,25.5 C27.1 | HB3.20 44.02,24 | 44.02,24 44.02,24.48 v44,24.5 | HB3.19 44.67,23.35 44.02,24 | HB4.20 24.02,24 | 24.02,24 24.02,25.02 v24.5,25.5 | HB4.19 24.68,23.35 24.02,24 | U7.5 U7.6 12,44.28 12.28,44 U7.7 12.75,43.25 13.15,42.85 C2.1 | R13.2 R14.1 | R16.2 31.15,35.85 31.75,35.25 U4.3 33.5,35.25 | R15.2 R8.2 42.5,36 43,35.5 43.7,35.5 U1.CA | C4.1 36,31 | 36,31 35.5,31 35,31.5 35,32 34.75,32.25 U4.10 34.75,34.25 33.75,35.25 33.5,35.25 | C10.1 33.25,37.6 U4.28 33.25,36.22 33.5,35.97 33.5,35.25 | 36,31 34.5,29.5 | 34.5,29.5 v31,29.5 | TP11.P$1 67.31,45.98 U9.2
  Top 0.4: U2.5 10.35,23.5 C8.1 C7.1 v11.5,21.5 | v10,37.5 12,37.5 12.5,38 12.5,40 13.15,40.65 C2.1 | v48.5,24.5 49.5,23.5 49.5,21 56.5,14 60,14 62.5,16.5 R13.2 | v49,46 49.5,46.5 49.5,49 57,56.5 61.35,56.5 R11.2 66.15,52.35 67.31,51.19 U9.2 | v40.5,35 40.5,34.85 R15.2
  Bottom 0.2: v31,44.5 v31,48 | v39,25.5 v39,22
  Bottom 0.4: 40.5,25.5 43,25.5 v44,24.5 v48.5,24.5 | 40.5,25.5 v39,25.5 v31,25.5 | v31,25.5 v24.5,25.5 20.5,21.5 v11.5,21.5 10,23 v10,37.5 10,42.5 13,45.5 v26,45.5 27,44.5 v31,44.5 v39,44.5 v45.5,44.5 47.5,44.5 v49,46 | v31,29.5 v31,25.5 | v40.5,35 40.5,25.5
BLUE
  Top 0.2: U9.28 | U9.28 55.89,21.24 R7.2 | TP22.P$1 55.88,26.25 U9.28
BOOT-SEL  (via drill 0.3)
  Top 0.2: Q2.3 v59,47 | v59,28.5 58.5,28 52.57,28 52.07,27.5 U9.25
  Bottom 0.2: v59,47 v59,28.5
CHIP-EN
  Top 0.2: R11.1 65.54,50.61 65.54,50.5 | U9.3 66.04,50.5 65.54,50.5 | 65.54,50.5 64.5,50.5 63.5,51.5 59.5,51.5 59,52 Q1.3
DTR  (via drill 0.3)
  Top 0.2: Q2.2 56.65,50.5 R10.1 55.35,50.65 v55,51 | U7.23 13.25,49.25 13,49.5 v13,52.5
  Bottom 0.2: v13,52.5 54,52.5 55,51.5 v55,51
GND  (via drill 0.3)
  Top 0.2: U5.29 34.6,44.9 U5.17 | U5.29 35.4,44.9 U5.10 35.4,48.05 C15.2 37.67,46.67 v39,48 | U5.3 35.4,44.1 | U5.26 35.4,44.1 | 35.4,44.1 U5.29 | U6.3 34.6,25.9 U6.29 | U6.17 35.4,25.1 U6.29 | U6.29 34.6,25.1 U6.10 34.6,21.95 C18.2 31.5,21.5 v31,22 | 44.67,45.67 v44.5,45.5 43.5,44.5 C21.2 | 24.68,46.5 24.68,44.83 v25,44.5 C13.2 | 45.33,25.18 v45,25.5 C24.2 | C27.2 26.5,25.5 v25.5,24.5 25.32,24.32 | U7.2 13.25,46.75 U7.THERM | U10.P$6 14.25,37.75 U10.P$9 | U4.5 32.75,34.1 U4.6
  Top 0.4: 22.5,17.1 22.73,16.88 HB4.3 22.73,13.72 | 23.5,17.1 23.38,16.98 HB4.4 23.38,13.62 | 26.5,17.1 26.62,16.98 HB4.9 26.62,13.62 | 27.5,17.1 27.27,16.88 HB4.10 27.27,13.72 | 43.5,17.1 43.38,16.98 HB3.4 43.38,13.88 | 42.5,17.1 42.73,16.88 HB3.3 42.73,13.78 | 46.5,17.1 46.62,16.98 HB3.9 46.62,13.62 | 47.5,17.1 47.27,16.88 HB3.10 47.27,13.72 | 47.5,52.9 47.27,53.12 HB2.3 47.27,56.23 | 46.5,52.9 46.62,53.02 HB2.4 46.62,56.3 | 43.5,52.9 43.38,53.02 HB2.9 43.38,56.38 | 42.5,52.9 42.73,53.12 HB2.10 42.73,56.33 | 23.5,52.9 23.38,53.02 HB1.9 23.38,56.38 | 22.5,52.9 22.73,53.12 HB1.10 22.73,56.27 | HB2.18 44.67,45.67 | HB3.18 45.33,25.18 | HB4.18 25.32,24.32 | 26.62,56.24 HB1.4 26.62,53.27 27,52.9 27.27,53.17 HB1.3 27.27,56.27 | HB1.18 24.68,46.5
  Top 1.2: 22.5,52.9 23.5,52.9 27,52.9 C28.- 33.95,52.9 | 47.5,52.9 46.5,52.9 43.5,52.9 42.5,52.9 C29.- 34.05,52.9 C5.2 | 47.5,17.1 46.5,17.1 43.5,17.1 42.5,17.1 C30.- 36.05,17.1 C22.2 35.95,17.1 33.95,17.1 | 22.5,17.1 23.5,17.1 26.5,17.1 27.5,17.1 C31.- 33.95,17.1 | 33.95,17.1 C25.2
  other vias: 35.5,35 39.5,31 11.5,42.5
  pour Top: -0.5,70.5 70.5,70.5 70.5,-0.5 -0.5,-0.5
  pour Bottom: -1,71 71,71 71,-1 -1,-1
GREEN
  Top 0.2: R6.2 57.5,23 58.44,23.94 58.44,24.49 TP21.P$1 58.43,26.25 U9.30
H1-AIN1
  Top 0.2: HB1.21 26.62,45.88 27,45.5 31.5,45.5 31.7,45.3 U5.16
H1-AIN2
  Top 0.2: HB1.22 27.27,46.23 27.5,46 31.5,46 31.8,45.7 U5.15
H1-APWM
  Top 0.2: HB1.23 27.93,46.58 28,46.5 31.5,46.5 32.5,47.5 33.5,47.5 33.8,47.2 U5.14
H1-BIN1
  Top 0.2: HB1.17 24.02,44.48 25,43.5 31.5,43.5 32.1,44.1 U5.19
H1-BIN2
  Top 0.2: HB1.16 23.38,44.12 24.5,43 31.5,43 32.2,43.7 U5.20
H1-BPWM
  Top 0.2: HB1.15 22.73,43.77 24,42.5 31.5,42.5 32.3,43.3 U5.21
H2-AIN1
  Top 0.2: HB2.21 46.62,44.62 45.5,43.5 38.5,43.5 38.3,43.7 U5.2
H2-AIN2
  Top 0.2: HB2.22 47.27,44.27 46,43 38.5,43 38.2,43.3 U5.1
H2-APWM
  Top 0.2: HB2.23 47.92,43.92 46.5,42.5 38.5,42.5 37.5,41.5 36.5,41.5 36.2,41.8 U5.28
H2-BIN1
  Top 0.2: HB2.17 44.02,46.02 43.5,45.5 38.5,45.5 37.9,44.9 U5.5
H2-BIN2
  Top 0.2: HB2.16 43.38,46.38 43,46 38.5,46 37.8,45.3 U5.6
H2-BPWM
  Top 0.2: HB2.15 42.73,46.73 42.5,46.5 38.5,46.5 37.7,45.7 U5.7
H3-AIN1
  Top 0.2: HB3.21 43.38,24.12 43,24.5 38.5,24.5 38.3,24.7 U6.16
H3-AIN2
  Top 0.2: HB3.22 42.73,23.77 42.5,24 38.5,24 38.2,24.3 U6.15
H3-APWM
  Top 0.2: HB3.23 42.08,23.43 42,23.5 38.5,23.5 37.5,22.5 36.5,22.5 36.2,22.8 U6.14
H3-BIN1
  Top 0.2: HB3.17 45.98,25.52 45,26.5 38.5,26.5 37.95,25.95 37.02,25.95 U6.19
H3-BIN2
  Top 0.2: HB3.16 46.62,25.88 45.5,27 38.5,27 37.8,26.3 U6.20
H3-BPWM
  Top 0.2: HB3.15 47.27,26.23 46,27.5 38.5,27.5 37.7,26.7 U6.21
H4-AIN1
  Top 0.2: HB4.21 23.38,25.38 24.5,26.5 31.5,26.5 31.7,26.3 U6.2
H4-AIN2
  Top 0.2: HB4.22 22.73,25.73 24,27 31.5,27 31.8,26.7 U6.1
H4-APWM
  Top 0.2: HB4.23 22.07,26.07 23.5,27.5 31.5,27.5 32.5,28.5 33.5,28.5 33.8,28.2 U6.28
H4-BIN1
  Top 0.2: HB4.17 25.98,23.98 26.5,24.5 31.5,24.5 32.1,25.1 U6.5
H4-BIN2
  Top 0.2: HB4.16 26.62,23.62 27,24 31.5,24 32.2,24.7 U6.6
H4-BPWM
  Top 0.2: HB4.15 27.27,23.27 27.5,23.5 31.5,23.5 32.3,24.3 U6.7
HB1-A1
  Top 0.4: HB1.1 28.57,56.92 28.5,57 | HB1.2 27.93,56.92 28,57
  Top 0.8: J8.2 31,58 30,57 28.5,57 28,57
HB1-A2
  Top 0.4: HB1.5 25.98,57.48 | 25.98,57.48 26,57.5 | HB1.6 25.32,56.83 25.98,57.48
  Top 0.8: J8.1 29,59 28.5,58.5 27,58.5 26,57.5
HB1-B1
  Top 0.4: HB1.12 21.43,56.92 21.5,57 | HB1.11 22.07,56.92 22,57
  Top 0.8: J9.1 19,58 20,57 21.5,57 22,57
HB1-B2
  Top 0.4: HB1.8 24.02,57.48 | 24.02,57.48 24,57.5 | HB1.7 24.68,56.83 24.02,57.48
  Top 0.8: J9.2 21,59 21.5,58.5 23,58.5 24,57.5
HB2-A1
  Top 0.4: HB2.2 47.92,56.92 48,57 | HB2.1 48.58,56.92 48.5,57
  Top 0.8: J10.2 51,58 50,57 48.5,57 48,57
HB2-A2
  Top 0.4: HB2.5 45.98,57.48 | 45.98,57.48 46,57.5 | HB2.6 45.33,56.83 45.98,57.48
  Top 0.8: J10.1 49,59 48.5,58.5 47,58.5 46,57.5
HB2-B1
  Top 0.4: HB2.12 41.42,56.92 41.5,57 | HB2.11 42.08,56.92 42,57
  Top 0.8: J11.1 39,58 40,57 41.5,57 42,57
HB2-B2
  Top 0.4: HB2.8 44.02,57.48 | 44.02,57.48 44,57.5 | HB2.7 44.67,56.83 44.02,57.48
  Top 0.8: J11.2 41,59 41.5,58.5 43,58.5 44,57.5
HB3-A1
  Top 0.4: HB3.2 42.08,13.07 42,13 | HB3.1 41.42,13.07 41.5,13
  Top 0.8: J12.2 39,12 40,13 41.5,13 42,13
HB3-A2
  Top 0.4: HB3.5 44.02,12.53 | 44.02,12.53 44,12.5 | HB3.6 44.67,13.18 44.02,12.53
  Top 0.8: J12.1 41,11 41.5,11.5 43,11.5 44,12.5
HB3-B1
  Top 0.4: HB3.12 48.58,13.07 48.5,13 | HB3.11 47.92,13.07 48,13
  Top 0.8: J13.1 51,12 50,13 48.5,13 48,13
HB3-B2
  Top 0.4: HB3.8 45.98,12.53 | 45.98,12.53 46,12.5 | HB3.7 45.33,13.18 45.98,12.53
  Top 0.8: J13.2 49,11 48.5,11.5 47,11.5 46,12.5
HB4-A1
  Top 0.4: HB4.2 22.07,13.07 22,13 | HB4.1 21.43,13.07 21.5,13
  Top 0.8: J14.2 19,12 20,13 21.5,13 22,13
HB4-A2
  Top 0.4: HB4.5 24.02,12.53 | 24.02,12.53 24,12.5 | HB4.6 24.68,13.18 24.02,12.53
  Top 0.8: J14.1 21,11 21.5,11.5 23,11.5 24,12.5
HB4-B1
  Top 0.4: HB4.11 27.93,13.07 28,13 | HB4.12 28.57,13.07 28.5,13
  Top 0.8: J15.1 31,12 30,13 28.5,13 28,13
HB4-B2
  Top 0.4: HB4.8 25.98,12.53 | 25.98,12.53 26,12.5 | HB4.7 25.32,13.18 25.98,12.53
  Top 0.8: J15.2 29,11 28.5,11.5 27,11.5 26,12.5
IMU-BOOT  (via drill 0.3)
  Top 0.2: U4.4 31.75,34.75 31.15,34.15 R16.1 29.85,34.15 v29,35 | v52.5,39 51.8,39.7 U9.16 50.57,39.72 TP17.P$1
  Bottom 0.2: v52.5,39 52.5,37.5 51,36 30,36 v29,35
IMU-INT  (via drill 0.3)
  Top 0.2: U4.14 36.75,32.75 37,32.5 41.5,32.5 42,33 v42.5,33 | v55.5,33 55.88,33.38 U9.11 TP4.P$1
  Bottom 0.2: v42.5,33 v55.5,33
IMU-RST  (via drill 0.3)
  Top 0.2: U4.11 35.25,32.75 36,32 v42,32 | v54.5,32 54.5,44.15 54.6,44.25 | 54.6,44.25 U9.12 | TP5.P$1 54.6,44.25
  Bottom 0.2: v42,32 v54.5,32
IO1-RST  (via drill 0.3)
  Top 0.2: U9.10 TP3.P$1 v57.15,47.09 | U5.23 34.2,41.7 34,41.5 v33,41.5
  Bottom 0.2: v33,41.5 38,41.5 40,43.5 48,43.5 51.59,47.09 v57.15,47.09
IO2-RST  (via drill 0.3)
  Top 0.2: U6.23 35.8,28.3 36,28.5 36.5,28.5 37,28 46.5,28 50.5,24 v50.5,21.5 | U9.26 TP16.P$1 53.33,21.67 v53.5,21.5
  Bottom 0.2: v50.5,21.5 v53.5,21.5
N$1
  Top 0.2: D2.C 18.5,37 19.5,38 R2.1
N$2
  Top 0.2: U7.3 7.5,46.25 7.25,46 J1.D+
N$3
  Top 0.2: U3.1 20.75,36 21.5,36 22.85,37.35 R2.2
N$4
  Top 0.2: U3.5 23.5,36.15 23.5,36.5 24.5,37.5 R4.2 25.15,36.85 26,36 JP1.1
N$6  (via drill 0.3)
  Top 0.2: U7.4 10.75,45.75 v10,45 | J1.D- 9.65,46.65 v10,47
  Bottom 0.2: v10,47 v10,45
N$7
  Top 0.4: S1.3 5.25,26.75 6,26 D1.C | U2.1 7.7,24.3 7.85,24.45 D1.C | Q3.2 9.9,29.05 C6.1 9.85,27.85 9.5,27.5 8.65,27.5 7.85,26.7 D1.C
N$8
  Top 0.4: S1.2 5.25,23.75 6,23 6,22.5 6.95,21.55 U2.3
N$9
  Top 0.2: U1.RED 43.75,31.25 51.5,23.5 51.5,20 55.5,16 58.5,16 59.5,17 R5.1
N$10
  Top 0.2: U1.BLUE 45.3,35.5 46,35.5 46.5,35 46.5,29.5 52.5,23.5 52.5,20 53.35,19.15 R7.1
N$11
  Top 0.2: U1.GREEN 45.25,30.25 52,23.5 52,20 55.5,16.5 56.5,16.5 57.5,17.5 R6.1
N$12
  Top 0.2: R10.2 56.65,52.5 Q1.1
N$13
  Top 0.2: Q2.1 61.35,50.5 R9.2
N$14
  Top 0.2: U4.16 38.25,34.25 38.5,34.5 38.5,35 39.5,36 R8.1
N$15
  Top 0.2: U4.15 38.3,33.3 39,34 R15.1
N$16
  Top 0.2: U4.9 34.25,32.25 33.85,31.85 C1.1
N$18
  Top 0.2: TP10.P$1 U9.4
N$19
  Top 0.2: TP9.P$1 U9.5
N$20
  Top 0.2: TP8.P$1 U9.6
N$21
  Top 0.2: TP7.P$1 U9.7
N$22
  Top 0.2: TP6.P$1 U9.13
RED
  Top 0.2: R5.2 59.69,21.04 U9.31 TP20.P$1
RTS  (via drill 0.3)
  Top 0.2: R9.1 61.35,52.5 Q1.2 59.95,55.05 59.5,55.5 58,55.5 v52,49.5 | U7.19 15.25,48.75 v16,49.5
  Bottom 0.2: v16,49.5 v52,49.5
RX  (via drill 0.3)
  Top 0.2: U7.21 14.25,49.25 14,49.5 v14,51.5 | v63.5,28.5 U9.34 | v63.5,49 v63.5,47
  Bottom 0.2: v14,51.5 53,51.5 55.5,49 v63.5,49 | v63.5,47 v63.5,28.5
S1-SIG  (via drill 0.3)
  Top 0.2: J4.3 v10.51,58.01 v10.5,58 | v67,40.5 59.5,40.5 58.5,41.5 58.5,44.18 U9.9 58.44,44.28 TP2.P$1
  Bottom 0.2: v67,40.5 67,53 62,58 v10.5,58
S2-SIG  (via drill 0.3, 0.35)
  Top 0.2: v68,41.5 60,41.5 59.69,41.81 U9.8 TP1.P$1 | v63.51,57.99 J5.3
  Bottom 0.2: v68,41.5 68,53.5 v63.51,57.99
S3-SIG
  Top 0.2: J6.3 59.49,11.49 63,15 64,15 67.31,18.31 U9.37 TP14.P$1
S4-SIG  (via drill 0.3)
  Top 0.2: J7.3 v6.49,11.99 v6.5,12 | v54.5,22.5 54.5,26.15 U9.27 54.58,26.23 TP15.P$1
  Bottom 0.2: v6.5,12 53,12 54.5,13.5 v54.5,22.5
SCL  (via drill 0.3)
  Top 0.2: U6.25 35,29 35.5,29.5 42.5,29.5 v43,30 | U9.36 66.04,20.89 R14.2 | U4.19 38.25,35.75 38.5,36 38.5,37 40,38.5 v40,39.5 45,39.5 47.5,37 v47.5,31 | U10.P$7 13.75,39.25 14,39.5 v15.5,39.5 | U5.25 35,41.5 37,39.5 v37.5,39.5 | U9.36 66,26.3 66,29 64,31 v53.5,31 | U9.36 66.06,26.24 TP18.P$1
  Bottom 0.2: v15.5,39.5 v37.5,39.5 v40,39.5 | v53.5,31 v47.5,31 44,31 v43,30
SDA  (via drill 0.3)
  Top 0.2: U6.24 35.4,28.4 36,29 v43.5,29 | R13.1 62.23,21.12 U9.33 | U4.20 37.25,37.75 39,39.5 v39,40.5 45.5,40.5 48.5,37.5 v48.5,30 | U10.P$8 13.25,39.75 14,40.5 v15.5,40.5 | U5.24 34.6,40.6 v34.5,40.5 | U9.33 62,26.49 62,28.5 60.5,30 v52.5,30 | TP19.P$1 U9.33
  Bottom 0.2: v15.5,40.5 v34.5,40.5 v39,40.5 | v52.5,30 v48.5,30 44.5,30 v43.5,29
TX  (via drill 0.3)
  Top 0.2: U7.20 14.75,49.25 15,49.5 v15,50.5 | U9.35 64.77,28.23 v64.5,28.5
  Bottom 0.2: v15,50.5 52.5,50.5 55,48 64,48 64.5,47.5 v64.5,28.5
V_BATT  (via drill 0.6, 0.6 pad 0.8)
  Top 0.2: U10.P$2 13.75,36.15 13.73,36.14 13.75,36.12 | C11.1 13.15,35.52 13.75,36.12 | 13.75,36.12 13.87,36 14.13,36 14.25,36.12 U10.P$3
  Top 0.4: HB1.24 28.57,50.02 28.5,50.1 | HB1.14 22.07,50.02 22,50.1 | HB1.13 21.43,50.02 21.5,50.1 | HB2.24 48.58,50.06 48.62,50.1 | HB2.14 42.08,50.07 42.11,50.1 | HB2.13 41.42,50.06 41.39,50.1 | HB4.13 28.57,20.03 28.7,19.9 | HB4.14 27.93,19.92 27.9,19.9 | HB4.24 21.43,19.98 21.5,19.9 | HB3.24 41.42,19.98 41.5,19.9 | HB3.14 47.92,19.98 48,19.9 | HB3.13 48.58,19.98 48.5,19.9 | U3.3 20.7,33.3 21.15,32.85 C3.1 21.15,30.65 20.5,30 Q3.3 15,31.5 13.15,33.35 C11.1 11.5,35 10.5,36 J2.2
  Top 0.8: J4.1 | v59.5,66.5 v59.51,66.49 | J7.1 | J6.1
  Top 1.2: 21.5,50.1 22,50.1 28.5,50.1 C28.+ 32.95,50.1 C5.1 C19.1 37.05,50.1 C29.+ 41.39,50.1 42.11,50.1 48.62,50.1 | 21.5,19.9 27.9,19.9 28.7,19.9 C31.+ 32.95,19.9 C25.1 C22.1 37.05,19.9 C30.+ 41.5,19.9 48,19.9 48.5,19.9 | J2.2 v4.5,36 | v6.5,66.5 J4.1 | v59.51,66.49 J5.1 | v10.5,3.5 J7.1 | v63.5,3.5 J6.1 | 21.43,50.02 14.77,56.68 v14.77,66.5 | 48.58,50.06 48.58,50.08 55.26,56.76 v55.26,66.49 v55.25,66.5 | 21.43,19.98 14.76,13.31 14.76,3.51 v14.77,3.5 | 48.58,19.98 48.58,19.93 55.22,13.28 v55.22,3.5
  Bottom 1.2: v59.5,66.5 v55.25,66.5 v14.77,66.5 v6.5,66.5 4.5,64.5 v4.5,36 4.5,5.5 6.5,3.5 v10.5,3.5 v14.77,3.5 v55.22,3.5 v63.5,3.5
V_USB  (via drill 0.3, 0.35)
  Top 0.2: U7.8 13.25,43.25 13.5,43 v16.5,43
  Top 0.4: D1.A 11,26 | 11,26 R12.2 | U3.4 24.45,34.05 v24.5,34 25.15,33.35 25.25,33.35 | JP1.2 26,34 25.35,33.35 25.25,33.35 | v11.5,31 12.95,31 Q3.1 | v11,27.5 11,26 | v18.5,32.5 D2.A | 25.25,33.35 25.25,32.6 C9.1 | v11.5,40.5 v7.5,44.5 | v7.5,47.5 7.3,47.3 J1.VBUS
  Bottom 0.4: v16.5,43 14,43 v11.5,40.5 v11.5,31 | v11.5,31 17,31 v18.5,32.5 23,32.5 v24.5,34 | v11.5,31 11.5,28 v11,27.5 | v7.5,44.5 v7.5,47.5

### Text on the board
tNames: S1 | M1 | M2 | M3 | M4 | S2 | U1 | S4 | M8 | M7 | M6 | M5 | S3
bNames: Blimpy Board 1.0 / Immersive Arts Space / ZHdK - Joël Gähwiler | Maximum Ratings / Battery 3A (cum.) / Actors 2A (indv.)